# Altium schematic sheet [1] Supply.SchDoc
size A4; DocumentNumber: 2; SheetNumber: 2; SheetTotal: 4
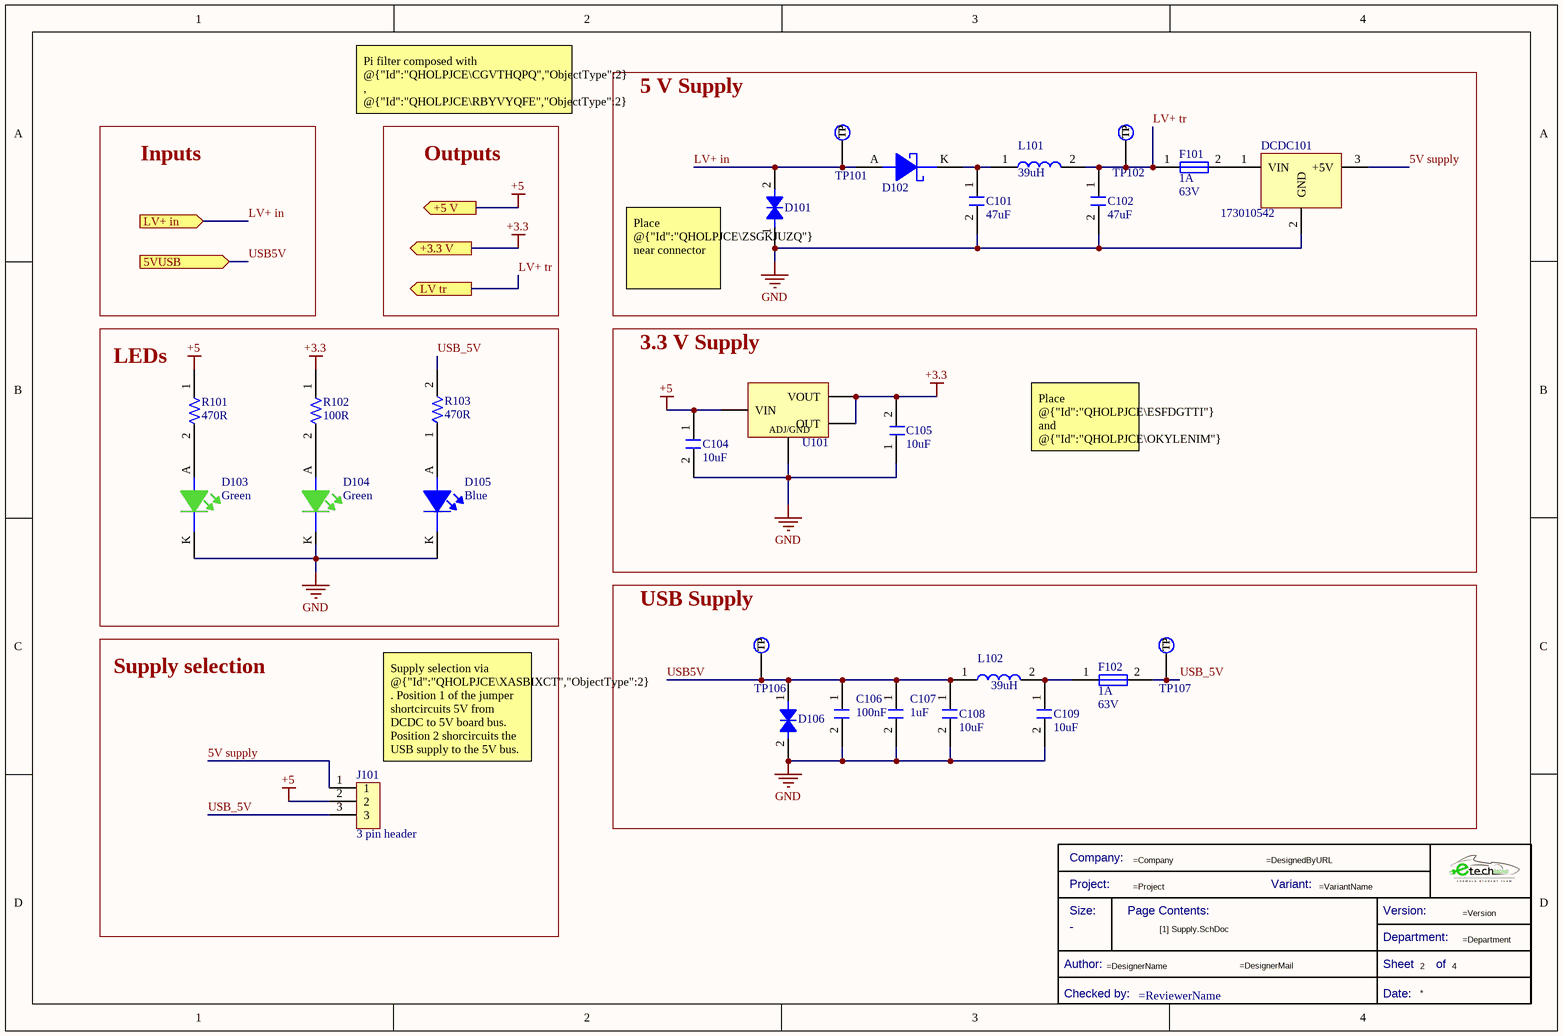
[diagram p0: [1] Supply.SchDoc]

## Parts
*?  Title Block_template  (value not drawn)  (graphical)
C101  Capacitance: 47uF  [C6.8n-2kV-1210FNPMLCC-X7R]  (hidden comment: C1210C682KGRACAUTO)
C102  Capacitance: 47uF  [C6.8n-2kV-1210FNPMLCC-X7R]  (hidden comment: C1210C682KGRACAUTO)
C104  Capacitance: 10uF  [C0805FNPC-R]  (hidden comment: 885012107014)
C105  Capacitance: 10uF  [C0805FNPC-R]  (hidden comment: 885012107014)
C106  Capacitance: 100nF  [C0805FNPC-R]  (hidden comment: 885012207098)
C107  Capacitance: 1uF  [C0805FNPC-R]  (hidden comment: 885012207103)
C108  10uF  [C0805FNPC-W]
C109  10uF  [C0805FNPC-W]
D101  824501261  [DTVS-DO-214AC]  (value not drawn)
D102  MBR0530  [DSC-SOD123]  (value not drawn)
D103  Color: Green  [LED_0805_WE]  (hidden comment: 150080GS75000)
D104  Color: Green  [LED_0805_WE]  (hidden comment: 150080GS75000)
D105  Color: Blue  [LED_1206_WE]  (hidden comment: 150120BS75000)
D106  824501131  [DTVS-DO-214AC]  (value not drawn)
DCDC101  173010542  [DCDC_Magi3c]
F101  Current Rating: 1A  Voltage Rating (DC): 63V  [Fuse_1206]  (hidden comment: 0437001.WRA)
F102  Current Rating: 1A  Voltage Rating (DC): 63V  [Fuse_1206]  (hidden comment: 0437001.WRA)
J101  3 pin header  [J3_PINHEADER]
L101  39uH  [L_47u-490mA_CF]
L102  39uH  [L_47u-490mA_CF]
R101  Resistance: 470R  [R0805FTK]  (hidden comment: CR0805-FX-4700GLF)
R102  Resistance: 100R  [R0805FTK]  (hidden comment: CR0805-FX-1000ELF)
R103  Resistance: 470R  [R0805FTK]  (hidden comment: CR0805-FX-4700GLF)
TP101  TestPoint  [TestPoint]  (value not drawn)  (no BOM)
TP102  TestPoint  [TestPoint]  (value not drawn)  (no BOM)
TP106  TestPoint  [TestPoint]  (value not drawn)  (no BOM)
TP107  TestPoint  [TestPoint]  (value not drawn)  (no BOM)
U101  LM1117IMP-3.3/NOPB  [LDO_10V-0.8/3V3-SOT223]  (value not drawn)

## Blocks framed on the sheet
5 V Supply: C101 C102 D101 D102 DCDC101 F101 L101 TP101 TP102
LEDs: D103-D105 R101-R103
3.3 V Supply: C104 C105 U101
USB Supply: C106-C109 D106 F102 L102 TP106 TP107
Supply selection: J101

## Ports
5VUSB (in), +3.3 V (out), +5 V (out), LV tr (out), LV+ in (in)

## Nets
+3.3: C105.2 R102.1 U101.2(OUT) U101.4(VOUT) ; port +3.3 V
+5: C104.1 J101.2 R101.1 U101.3(VIN) ; port +5 V
GND: C101.2 C102.2 C104.2 C105.1 C106.2 C107.2 C108.2 C109.2 D101.1 D103.K D104.K D105.K D106.2 DCDC101.2(GND) U101.1(ADJ/GND)
5V supply: DCDC101.3(+5V) J101.1
LV+ in: D101.2 D102.A TP101.1(TP) ; port LV+ in
LV+ tr: C102.1 F101.1 L101.2 TP102.1(TP) ; port LV tr
USB5V: C106.1 C107.1 C108.1 D106.1 L102.1 TP106.1(TP) ; port 5VUSB
USB_5V: F102.2 J101.3 R103.2 TP107.1(TP)
NetC101_1: C101.1 D102.K L101.1
NetC109_1: C109.1 F102.1 L102.2
NetD103_A: D103.A R101.2
NetD104_A: D104.A R102.2
NetD105_A: D105.A R103.1
NetDCDC101_1: DCDC101.1(VIN) F101.2

## Notes on the sheet
- Pi filter composed with @{"Id":"QHOLPJCE\CGVTHQPQ","ObjectType":2} , @{"Id":"QHOLPJCE\RBYVYQFE","ObjectType":2} and @{"Id":"QHOLPJCE\QHWORVIP"} is calculated to be cutting all frequencies higher than 7340 Hz
- Inputs
- Outputs
- Place @{"Id":"QHOLPJCE\ZSGKJUZQ"} near connector
- Place @{"Id":"QHOLPJCE\ESFDGTTI"} and @{"Id":"QHOLPJCE\OKYLENIM"} near @{"Id":"QHOLPJCE\XKTUAFZT"}
- (near J101) Supply selection via @{"Id":"QHOLPJCE\XASBIXCT","ObjectType":2} . Position 1 of the jumper shortcircuits 5V from DCDC to 5V board bus. Position 2 shorcircuits the USB supply to the 5V bus.
- (in symbol Title Block_template) Company:; Project:; Variant:; Size:; Page Contents:; Version:; Department:; Author:; Sheet; of; Checked by:; Date:

## Library data of the parts
*? = Title Block_template: Standard Title Block; .Creator: GP; Category: Title Block; .PCBcheck: GP; .SCHcheck: GP; Checked by:: =ReviewerName; Size: -
C101 C102 = C6.8n-2kV-1210FNPMLCC-X7R: Cap, AEC-Q200, 6800PF, 2KV, Mlcc, 1210;; Manufacturer: KEMET; Dielectric: X7R; Tolerance: 10%; .Creator: DR; Supplier 1: Digi-Key; Manufacturer Part Number: C1210C682KGRACAUTO; RoHS: Yes; Category: Ceramic Capacitors; Stock 1: 1000; Pricing 1: 1=0,78000, 10=0,55500, 50=0,41940, 100=0,36530, 500=0,27060 (USD); Case/Package: 1210; Case Code (Imperial): 1210; Case Code (Metric): 3225; Weight: 0.000564oz; Min Operating Temperature: -55°C; Max Operating Temperature: 125°C; Packaging: Tape and Reel; Termination: SMD/SMT; Voltage Rating (DC): 2kV; Package Quantity: 1000; Length: 3.2mm; Width: 2.5mm; RoHS Compliant: Yes; ComponentLink1URL: http://www.mouser.com/ds/2/212/KEM_C1010_X7R_HV_SMD-345925.pdf?src-supplier=Mouser; ComponentLink1Description: http://www.mouser.com/ds/2/212/KEM_C1010_X7R_HV_SMD-345925.pdf?src-supplier=Mouser; Supplier Part Number 1: 399-C1210C682KGRACAUTOCT-ND
C104 C105 = C10u-16V-0805FNPC-X5R: Multilayer Ceramic Capacitor, Wcap-Csgp Series, 10 F, 20%, X5R, 16 V, 0805 [2012 Metric] Rohs Compliant: Yes; Manufacturer 1: Wurth Electronics; Voltage Rating: 16V; .Creator: DR; Supplier 1: RSComponents; Manufacturer Part Number 1: 885012107014; RoHS: Yes; Category: Ceramic Capacitors; Stock 1: 81550; Pricing 1: 50=0,21000, 250=0,20200, 500=0,19100, 1000=0,17400, 2500=0,14700 (GBP); Mount: Surface Mount; Case/Package: 0805; Case Code (Metric): 2012; Case Code (Imperial): 0805; Min Operating Temperature: -55°C; Max Operating Temperature: 85°C; Packaging: Cut Tape; Dielectric: X5R; Tolerance: 20%; Voltage Rating (DC): 16V; Length: 0.079inch; Width: 0.049inch; Thickness: 0.057inch; REACH SVHC: Unknown; RoHS Compliant: Yes; ComponentLink1URL: http://www.farnell.com/datasheets/1958454.pdf?src-supplier=Farnell; ComponentLink1Description: http://www.farnell.com/datasheets/1958454.pdf?src-supplier=Farnell; ComponentLink2URL: http://www.farnell.com/datasheets/1958454.pdf?src-supplier=Element14; ComponentLink2Description: http://www.farnell.com/datasheets/1958454.pdf?src-supplier=Element14; ComponentLink3URL: https://katalog.we-online.de/pbs/datasheet/885012107014.pdf?src-supplier=Digi-Key; ComponentLink3Description: https://katalog.we-online.de/pbs/datasheet/885012107014.pdf?src-supplier=Digi-Key; ComponentLink4URL: http://www.farnell.com/datasheets/1958454.pdf?src-supplier=Newark; ComponentLink4Description: http://www.farnell.com/datasheets/1958454.pdf?src-supplier=Newark; Supplier Part Number 1: 1813526
C106 = C100n-50V-0805FNPC-X7R: Cap, 0.1ΜF, 50V, 10%, X7R, 0805; Manufacturer 1: Wurth Electronics; .Creator: DR; Supplier 1: RSComponents; Manufacturer Part Number 1: 885012207098; RoHS: Yes; Category: Ceramic Capacitors; Stock 1: 8000; Pricing 1: 100=0,10200, 500=0,07100, 2000=0,06100 (GBP); Mount: Surface Mount; Case/Package: 0805; Case Code (Metric): 2012; Case Code (Imperial): 0805; Min Operating Temperature: -55°C; Max Operating Temperature: 125°C; Packaging: Cut Tape; Voltage Rating: 50V; Dielectric: X7R; Tolerance: 10%; Voltage Rating (DC): 50V; Length: 0.079inch; Width: 0.049inch; Thickness: 0.035inch; REACH SVHC: Unknown; RoHS Compliant: Yes; ComponentLink1URL: http://www.farnell.com/datasheets/1958498.pdf?src-supplier=Farnell; ComponentLink1Description: http://www.farnell.com/datasheets/1958498.pdf?src-supplier=Farnell; ComponentLink2URL: http://www.farnell.com/datasheets/1958498.pdf?src-supplier=Element14; ComponentLink2Description: http://www.farnell.com/datasheets/1958498.pdf?src-supplier=Element14; ComponentLink3URL: https://katalog.we-online.de/pbs/datasheet/885012207098.pdf?src-supplier=Digi-Key; ComponentLink3Description: https://katalog.we-online.de/pbs/datasheet/885012207098.pdf?src-supplier=Digi-Key; ComponentLink4URL: http://www.farnell.com/datasheets/1958498.pdf?src-supplier=Newark; ComponentLink4Description: http://www.farnell.com/datasheets/1958498.pdf?src-supplier=Newark; Supplier Part Number 1: 1813493
C107 = C1u-50V-0805FNPC-X7R: Multilayer Ceramic Capacitor, Wcap-Csgp Series, 1 F, 10%, X7R, 50 V, 0805 [2012 Metric] Rohs Compliant: Yes; Manufacturer 1: Wurth Electronics; Voltage Rating: 50V; .Creator: GP; Supplier 1: RSComponents; Manufacturer Part Number 1: 885012207103; RoHS: Yes; Category: Ceramic Capacitors; Stock 1: 5100; Pricing 1: 50=0,27200, 250=0,25300, 500=0,22800, 1250=0,20100, 2500=0,17100 (GBP); Mount: Surface Mount; Case/Package: 0805; Case Code (Metric): 2012; Case Code (Imperial): 0805; Min Operating Temperature: -55°C; Max Operating Temperature: 85°C; Packaging: Cut Tape; Dielectric: X7R; Tolerance: 10%; Voltage Rating (DC): 50V; Length: 0.079inch; Width: 0.049inch; Thickness: 0.053inch; REACH SVHC: Unknown; RoHS Compliant: Yes; ComponentLink1URL: http://www.farnell.com/datasheets/1958501.pdf?src-supplier=Farnell; ComponentLink1Description: http://www.farnell.com/datasheets/1958501.pdf?src-supplier=Farnell; ComponentLink2URL: http://www.farnell.com/datasheets/1958501.pdf?src-supplier=Element14; ComponentLink2Description: http://www.farnell.com/datasheets/1958501.pdf?src-supplier=Element14; ComponentLink3URL: https://katalog.we-online.de/pbs/datasheet/885012107003.pdf?src-supplier=Digi-Key; ComponentLink3Description: https://katalog.we-online.de/pbs/datasheet/885012107003.pdf?src-supplier=Digi-Key; ComponentLink4URL: http://www.farnell.com/datasheets/1958501.pdf?src-supplier=Newark; ComponentLink4Description: http://www.farnell.com/datasheets/1958501.pdf?src-supplier=Newark; Supplier Part Number 1: 1813523
C108 C109 = C10uF-50V-0805FNPC
D101 = DTVS-26V-DO-214AC: TVS diode [Würth Elektronik] 824501261 TVS diode; Manufacturer: Wurth Electronics; Number of Bidirectional Channels: 1; Reverse Standoff Voltage: 26V; Min Breakdown Voltage: 30.4V; Clamping Voltage: 42.1V; Peak Pulse Power: 400W; Power Line Protection: No; Polarity: Bidirectional; Peak Pulse Current: 9.5A; .Creator: DO; Supplier 1: RSComponents; Manufacturer Part Number: 824501261; RoHS: Yes; Category: TVS Diodes; Stock 1: 1; Pricing 1: 50=0,29400, 250=0,26100, 500=0,21200, 1000=0,20100, 2000=0,19600 (USD); Mount: Surface Mount; Number of Pins: 2; Min Operating Temperature: -65°C; Max Operating Temperature: 150°C; Packaging: Cut Tape; Max Breakdown Voltage: 30.4V; Resistor Type: Zener; REACH SVHC: Unknown; RoHS Compliant: Yes; ComponentLink1URL: http://www.farnell.com/datasheets/2036389.pdf?src-supplier=Farnell; ComponentLink1Description: http://www.farnell.com/datasheets/2036389.pdf?src-supplier=Farnell; ComponentLink2URL: http://www.farnell.com/datasheets/2036389.pdf?src-supplier=Element14; ComponentLink2Description: http://www.farnell.com/datasheets/2036389.pdf?src-supplier=Element14; ComponentLink3URL: https://katalog.we-online.de/pbs/datasheet/824501261.pdf?src-supplier=Digi-Key; ComponentLink3Description: https://katalog.we-online.de/pbs/datasheet/824501261.pdf?src-supplier=Digi-Key; Supplier Part Number 1: 9217305; ComponentLink4Description: Where buy it; ComponentLink4URL: https://www.we-online.com/catalog/en/WE-TVSP?sq=824501261#824501261
D102 = DSC-0.5/30-SOD123: VR=30V IF=500mA 30pF P=410mW; Element Configuration: Single; Forward Voltage: 430mV; Peak Non-Repetitive Surge Current: 5.5A; Average Rectified Current: 500mA; Max Reverse Leakage Current: 130uA; Max Reverse Voltage (DC): 30V; Polarity: Standard; .Creator: GP; Category: Diode; ComponentLink1Description: Datasheet; ComponentLink1URL: *; ComponentLink2Description: Where buy it; ComponentLink2URL: *; Supplier 1: Newark; Stock 1: 9; Pricing 1: 1=0,34400, 10=0,23900, 100=0,12200, 500=0,10000 (USD); Mount: Surface Mount; Contact Plating: Tin,Matte; Weight: 0.03g; Package Quantity: 1; Max Surge Current: 5.5A; Forward Current: 500mA; Max Reverse Current: 130uA; Max Repetitive Reverse Voltage (Vrrm): 30V; Max Forward Surge Current (Ifsm): 5.5A; Voltage Rating (DC): 30V; Current Rating: 500mA; Output Current: 500mA; Series: -; Length: 2.7mm; Width: 1.6mm; Height: 1.03mm; Radiation Hardening: No; RoHS Compliant: Yes; REACH SVHC: No SVHC; Lead Free: Lead Free; ComponentLink3URL: https://datasheet.ciiva.com/30479/0900766b810e2512-30479401.pdf?src-supplier=RSComponents; ComponentLink3Description: https://datasheet.ciiva.com/30479/0900766b810e2512-30479401.pdf?src-supplier=RSComponents; ComponentLink4URL: https://datasheet.ciiva.com/34301/974753-34301826.pdf?src-supplier=Jameco; ComponentLink4Description: https://datasheet.ciiva.com/34301/974753-34301826.pdf?src-supplier=Jameco; ComponentLink5URL: https://datasheet.ciiva.com/910/mbr0530-910516.pdf?src-supplier=Digi-Key; ComponentLink5Description: https://datasheet.ciiva.com/910/mbr0530-910516.pdf?src-supplier=Digi-Key; ComponentLink6URL: https://datasheet.ciiva.com/25931/mbr0530-25931989.pdf?src-supplier=Avnet+Europe; ComponentLink6Description: https://datasheet.ciiva.com/25931/mbr0530-25931989.pdf?src-supplier=Avnet+Europe; ComponentLink7URL: https://datasheet.ciiva.com/8300/mbr0530-8300905.pdf?src-supplier=Avnet; ComponentLink7Description: https://datasheet.ciiva.com/8300/mbr0530-8300905.pdf?src-supplier=Avnet; ComponentLink8URL: https://datasheet.ciiva.com/17318/mbr0530-17318568.pdf?src-supplier=Future+Electronics; ComponentLink8Description: https://datasheet.ciiva.com/17318/mbr0530-17318568.pdf?src-supplier=Future+Electronics; ComponentLink9URL: https://datasheet.ciiva.com/15144/getdatasheetpartid-86760-15144598.pdf?src-supplier=Verical; ComponentLink9Description: https://datasheet.ciiva.com/15144/getdatasheetpartid-86760-15144598.pdf?src-supplier=Verical; ComponentLink10URL: https://datasheet.ciiva.com/910/mbr0530-910518.pdf?src-supplier=Digi-Key; ComponentLink10Description: https://datasheet.ciiva.com/910/mbr0530-910518.pdf?src-supplier=Digi-Key; Supplier Part Number 1: 15R3453; Parameter 1: *
D103 D104 = LEDGS-0805-450: Led, Green, 520 Nm, 3.2 V, 30 Ma, 450 Mcd Rohs Compliant: Yes; Manufacturer 1: Wurth Electronics; Viewing Angle: 140°; Lens Style: Clear,Rectangular; Luminous Intensity: 450mcd; Forward Voltage: 3.2V; Wavelength: 520nm; Forward Current: 30mA; Test Current: 20mA; .Creator: GP; ComponentLink1Description: Datasheet; ComponentLink1URL: https://www.we-online.com/catalog/datasheet/150080GS75000.pdf; ComponentLink2Description: Where buy it; ComponentLink2URL: https://katalog.we-online.de/en/led/WL-SMCW/150080GS75000; Supplier 1: RSComponents; Manufacturer Part Number 1: 150080GS75000; RoHS: Yes; Category: LEDs; Stock 1: 4350; Pricing 1: 50=0,19300, 500=0,12900, 1000=0,12300, 2000=0,11700, 4000=0,11100 (USD); Mount: Surface Mount; Case/Package: 0805; Case Code (Metric): 2012; Case Code (Imperial): 0805; Min Operating Temperature: -40°C; Max Operating Temperature: 85°C; Package Quantity: 4000; Packaging: Cut Tape; Dominant Wavelength: 520nm; Length: 2mm; Width: 1.25mm; Height: 0.7mm; REACH SVHC: Unknown; RoHS Compliant: Yes; ComponentLink3URL: https://datasheet.ciiva.com/29563/150080gs75000-29563008.pdf?src-supplier=Digi-Key; ComponentLink3Description: https://datasheet.ciiva.com/29563/150080gs75000-29563008.pdf?src-supplier=Digi-Key; ComponentLink4URL: https://datasheet.ciiva.com/29279/759434-da-01-en-chipled-0805-w-kl-gruen-150080gs75000-29279039.pdf?src-supplier=Conrad; ComponentLink4Description: https://datasheet.ciiva.com/29279/759434-da-01-en-chipled-0805-w-kl-gruen-150080gs75000-29279039.pdf?src-supplier=Conrad; Supplier Part Number 1: 8154221
D105 = LEDBS-1206-145: Led, Blue, 470 Nm, 3.2 V, 30 Ma, 145 Mcd Rohs Compliant: Yes; Manufacturer: Wurth Electronics; Luminous Intensity: 145mcd; Viewing Angle: 140°; Wavelength: 470nm; Forward Current: 30mA; Lens Style: Clear,Rectangular; Test Current: 20mA; Forward Voltage: 3.2V; .Creator: GP; Supplier 1: RSComponents; Manufacturer Part Number: 150120BS75000; RoHS: Yes; Category: LEDs; Stock 1: 1; Pricing 1: 50=0,23200, 500=0,16400, 750=0,15500, 1500=0,15000, 3000=0,14200 (USD); Mount: Surface Mount; Case/Package: 1206; Case Code (Metric): 3216; Case Code (Imperial): 1206; Min Operating Temperature: -40°C; Max Operating Temperature: 85°C; Package Quantity: 3000; Packaging: Tape and Reel; Dominant Wavelength: 470nm; Length: 3.2mm; Width: 1.6mm; Height: 0.68mm; REACH SVHC: Unknown; RoHS Compliant: Yes; ComponentLink1URL: https://datasheet.ciiva.com/22656/150120bs75000-22656976.pdf?src-supplier=Element14; ComponentLink1Description: https://datasheet.ciiva.com/22656/150120bs75000-22656976.pdf?src-supplier=Element14; ComponentLink2URL: https://datasheet.ciiva.com/29279/759440-da-01-en-chipled-1206-w-kl-blau-150120bs75000-29279045.pdf?src-supplier=Conrad; ComponentLink2Description: https://datasheet.ciiva.com/29279/759440-da-01-en-chipled-1206-w-kl-blau-150120bs75000-29279045.pdf?src-supplier=Conrad; ComponentLink3URL: https://datasheet.ciiva.com/29561/150120bs75000-29561882.pdf?src-supplier=Digi-Key; ComponentLink3Description: https://datasheet.ciiva.com/29561/150120bs75000-29561882.pdf?src-supplier=Digi-Key; Supplier Part Number 1: 8154243; ComponentLink4Description: Where buy it; ComponentLink4URL: https://www.we-online.com/catalog/en/WL-SMCW?sq=150120BS75000#150120BS75000
D106 = DTVS-13V-DO-214AC: Tvs Diode, 400W, 13V, Bidir, DO-214AC; Manufacturer: Wurth Electronics; Number of Bidirectional Channels: 1; Min Breakdown Voltage: 15.15V; Clamping Voltage: 21.5V; Power Line Protection: No; Polarity: Bidirectional; Peak Pulse Current: 18.6A; .Creator: DO; Supplier 1: Digi-Key; Manufacturer Part Number: 824501131; RoHS: Yes; Category: TVS Diodes; Stock 1: 1000; Pricing 1: 1=0,27000 (USD); Mount: Surface Mount; Number of Pins: 2; Min Operating Temperature: -65°C; Max Operating Temperature: 150°C; Packaging: Cut Tape; Reverse Standoff Voltage: 13V; Peak Pulse Power: 400W; Max Breakdown Voltage: 15.15V; Resistor Type: Zener; REACH SVHC: Unknown; RoHS Compliant: Yes; ComponentLink1URL: https://katalog.we-online.de/pbs/datasheet/824501131.pdf?src-supplier=Digi-Key; ComponentLink1Description: https://katalog.we-online.de/pbs/datasheet/824501131.pdf?src-supplier=Digi-Key; ComponentLink2URL: http://www.farnell.com/datasheets/2036399.pdf?src-supplier=Element14; ComponentLink2Description: http://www.farnell.com/datasheets/2036399.pdf?src-supplier=Element14; ComponentLink3Description: Where buy it; ComponentLink3URL: https://www.we-online.com/catalog/en/WE-TVSP?sq=824501131#824501131; Supplier Part Number 1: 732-824501131CT-ND
DCDC101 = DCDC-42V/5V-1A: Würth Elektronik 8-42V to 5V 1A DC-DC; Manufacturer 1: Wurth Electronics; Number of Outputs: 1; Min Input Voltage: 8V; Max Input Voltage: 42V; Efficiency: 93%; .Creator: DR; Supplier 1: RSComponents; Manufacturer Part Number 1: 173010542; RoHS: Yes; Stock 1: 1; Pricing 1: 1=12,22500, 8=10,96900, 21=10,68900 (USD); Mount: Through Hole; Min Operating Temperature: -40°C; Max Operating Temperature: 85°C; Features: UVLO,OCP,OTP,SCP; Packaging: Rail/Tube; Voltage - Output 1: 5V; Max Output Current: 1A; RoHS Compliant: Yes; ComponentLink1URL: http://www.farnell.com/datasheets/2192895.pdf?src-supplier=Farnell; ComponentLink1Description: http://www.farnell.com/datasheets/2192895.pdf?src-supplier=Farnell; ComponentLink2URL: http://www.farnell.com/datasheets/2192895.pdf?src-supplier=Newark; ComponentLink2Description: http://www.farnell.com/datasheets/2192895.pdf?src-supplier=Newark; ComponentLink3URL: https://katalog.we-online.de/pm/datasheet/173010542.pdf?src-supplier=Digi-Key; ComponentLink3Description: https://katalog.we-online.de/pm/datasheet/173010542.pdf?src-supplier=Digi-Key; Supplier Part Number 1: 1447809
F101 F102 = Fuse_1A_63V_1206: Fuse Chip Fast Acting 1A 63V SMD Solder Pad 1206 Ceramic T/R Automotive; Manufacturer: Littelfuse; Fuse Type: Board Mount (Cartridge Style Excluded); Approvals: CSA,cURus; .Creator: DO; Supplier 1: Digi-Key; Manufacturer Part Number: 0437001.WRA; RoHS: Yes; Category: Fuses; Stock 1: 5820; Pricing 1: 1=1,52000, 5=1,47000, 10=1,37600, 50=1,13860, 100=0,94880, 250=0,92508, 500=0,78276, 1000=0,68788 (USD); Mount: Surface Mount; Case/Package: 1206; Case Code (Imperial): 1206; Case Code (Metric): 3216; Min Operating Temperature: -55°C; Max Operating Temperature: 150°C; Packaging: Tape and Reel; Voltage Rating (AC): 63V; ComponentLink1URL: https://www.littelfuse.com/~/media/electronics/datasheets/fuses/littelfuse_fuse_437a_datasheet.pdf.pdf?src-supplier=Digi-Key; ComponentLink1Description: https://www.littelfuse.com/~/media/electronics/datasheets/fuses/littelfuse_fuse_437a_datasheet.pdf.pdf?src-supplier=Digi-Key; Supplier Part Number 1: F10001CT-ND; ComponentLink2Description: Where buy it; ComponentLink2URL: https://www.mouser.es/ProductDetail/Littelfuse/0437001WRA?qs=DXv0QSHKF4z9CJhPXjxR%252BA%3D%3D
J101 = J_Pinheader_1x3: 61300311121
L101 L102 = L_47u-490mA_CF: Inductor Power Unshielded Wirewound 47uH 10% 100KHz Ferrite 490mA 546mOhm DCR T/R; Manufacturer: Sumida; Manufacturer Part Number: CDC5D23BNP-470KC; DC Resistance (DCR): 546mR; .Creator: GP; Supplier 1: Mouser; RoHS: Yes; Category: Fixed Inductors; Stock 1: 3779; Pricing 1: 1=0,95000, 10=0,71100, 50=0,71100, 100=0,59700, 1000=0,40600, 10000=0,38100 (USD); Mount: Surface Mount; Case/Package: Nonstandard; Core Material: Ferrite; Weight: 0.007584oz; Min Operating Temperature: -40°C; Max Operating Temperature: 100°C; Tolerance: 10%; Shielding: Unshielded; Packaging: Tape and Reel; Package Quantity: 2000; Current Rating: 490mA; Inductance: 47uH; Max DC Current: 490mA; Termination: SMD/SMT; Test Frequency: 100kHz; Series: CDC5D23B; Length: 0.228inch; Width: 5.8mm; Height: 2.5mm; Height - Seated (Max): 0.098inch; Lead Free: Lead Free; RoHS Compliant: Yes; ComponentLink1URL: http://www.mouser.com/ds/2/390/CDC5D23B-465898.pdf?src-supplier=Mouser; ComponentLink1Description: http://www.mouser.com/ds/2/390/CDC5D23B-465898.pdf?src-supplier=Mouser; ComponentLink3URL: http://products.sumida.com/products/pdf/CDC5D23B.pdf?src-supplier=Digi-Key; ComponentLink3Description: http://products.sumida.com/products/pdf/CDC5D23B.pdf?src-supplier=Digi-Key; Supplier Part Number 1: 851-CDC5D23BNP-470KC
R101 R103 = R470-0805FTK: Res Thick Film 0805 470 Ohm 1% 1/8W ±100ppm/°C Molded SMD SMD Paper Tape on Plastic Reel; Manufacturer 1: Bourns; Power Rating: 125mW; Voltage Rating: 150V; .Creator: DR; Supplier 1: Arrow Electronics; Manufacturer Part Number 1: CR0805-FX-4700GLF; RoHS: Yes; Category: Chip SMD Resistors; Stock 1: 12623; Pricing 1: 1=0,00990, 10=0,00980, 25=0,00950, 50=0,00940, 100=0,00930, 250=0,00920, 500=0,00910, 1000=0,00890, 3000=0,00870, 6000=0,00860 (USD); Mount: Surface Mount; Case/Package: 0805; Number of Pins: 2; Case Code (Imperial): 0805; Case Code (Metric): 2012; Contact Plating: Tin; Min Operating Temperature: -55°C; Max Operating Temperature: 155°C; Packaging: Tape and Reel; Tolerance: 1%; Resistor Type: Thick Film; Termination: SMD/SMT; Temperature Coefficient: 100ppm/°C; Voltage Rating (DC): 150V; Features: Moisture Resistant; Series: CR0805; Max Power Dissipation: 125mW; Number of Terminations: 2; Resistance Tolerance: 1%; Construction: Rectangular; Technology: THICK FILM; Length: 2mm; Height: 0.5mm; Depth: 1.25mm; Thickness: 508um; Radiation Hardening: No; REACH SVHC: No SVHC; Military Standard: Not; ComponentLink1URL: https://datasheet.ciiva.com/11808/0900766b80fcdb72-11808686.pdf?src-supplier=RSComponents; ComponentLink1Description: https://datasheet.ciiva.com/11808/0900766b80fcdb72-11808686.pdf?src-supplier=RSComponents; ComponentLink2URL: https://datasheet.ciiva.com/7985/1856384-7985880.pdf?src-supplier=Element14; ComponentLink2Description: https://datasheet.ciiva.com/7985/1856384-7985880.pdf?src-supplier=Element14; ComponentLink3URL: https://datasheet.ciiva.com/22693/1902866-22693247.pdf?src-supplier=Element14; ComponentLink3Description: https://datasheet.ciiva.com/22693/1902866-22693247.pdf?src-supplier=Element14; ComponentLink4URL: https://datasheet.ciiva.com/5541/chpreztr-5541930.pdf?src-supplier=Mouser; ComponentLink4Description: https://datasheet.ciiva.com/5541/chpreztr-5541930.pdf?src-supplier=Mouser; Supplier Part Number 1: CR0805-FX-4700GLF
R102 = R100-0805FTK: Res Thick Film 0805 100 Ohm 1% 1/8W ±100ppm/°C Molded SMD SMD Paper Tape on Plastic Reel; Manufacturer 1: Bourns; Power Rating: 125mW; Voltage Rating: 150V; .Creator: DR; Supplier 1: Arrow Electronics; Manufacturer Part Number 1: CR0805-FX-1000ELF; RoHS: Yes; Category: Chip SMD Resistors; Stock 1: 49802; Pricing 1: 1=0,05840, 10=0,03430, 25=0,01780, 100=0,00750, 250=0,00560, 500=0,00490, 3000=0,00470 (USD); Mount: Surface Mount; Case/Package: 0805; Number of Pins: 2; Contact Plating: Tin; Case Code (Imperial): 0805; Case Code (Metric): 2012; Min Operating Temperature: -55°C; Max Operating Temperature: 155°C; Tolerance: 1%; Resistor Type: Thick Film; Temperature Coefficient: 100ppm/°C; Packaging: Tape and Reel; Package Quantity: 1; Termination: SMD/SMT; Number of Terminations: 2; Max Power Dissipation: 125mW; Voltage Rating (DC): 150V; Features: Moisture Resistant; Series: CR0805; Resistance Tolerance: 1%; Construction: Rectangular; Technology: THICK FILM; Length: 2mm; Width: 1.25mm; Height: 0.5mm; Depth: 1.25mm; Thickness: 508um; Radiation Hardening: No; REACH SVHC: No SVHC; Military Standard: Not; RoHS Compliant: Yes; ComponentLink1URL: https://datasheet.ciiva.com/11809/0900766b80fcdb72-11809178.pdf?src-supplier=RSComponents; ComponentLink1Description: https://datasheet.ciiva.com/11809/0900766b80fcdb72-11809178.pdf?src-supplier=RSComponents; ComponentLink2URL: https://datasheet.ciiva.com/6547/chpreztr-6547413.pdf?src-supplier=Digi-Key; ComponentLink2Description: https://datasheet.ciiva.com/6547/chpreztr-6547413.pdf?src-supplier=Digi-Key; ComponentLink3URL: https://datasheet.ciiva.com/6547/chpreztr-6547414.pdf?src-supplier=Digi-Key; ComponentLink3Description: https://datasheet.ciiva.com/6547/chpreztr-6547414.pdf?src-supplier=Digi-Key; ComponentLink4URL: https://datasheet.ciiva.com/6547/chpreztr-6547415.pdf?src-supplier=Digi-Key; ComponentLink4Description: https://datasheet.ciiva.com/6547/chpreztr-6547415.pdf?src-supplier=Digi-Key; ComponentLink5URL: https://datasheet.ciiva.com/9120/chpreztr-9120744.pdf?src-supplier=Avnet; ComponentLink5Description: https://datasheet.ciiva.com/9120/chpreztr-9120744.pdf?src-supplier=Avnet; Supplier Part Number 1: CR0805-FX-1000ELF
TP101 TP102 TP106 TP107 = TestPoint: Test Point 1x1 mm; .Creator: GP; Category: TestPoint; .PCBcheck: GP; .SCHcheck: GP
U101 = LDO_10V-0.8/3V3-SOT223: LDO Regulator Pos 3.3V 0.8A 4-Pin(3+Tab) SOT-223 T/R / IC REG LDO 3.3V 0.8A SOT223; Manufacturer: Texas Instruments; Number of Outputs: 1; Max Input Voltage: 15V; Max Output Current: 800mA; Polarity: Positive; Quiescent Current: 15mA; Accuracy: 1%; Output Type: Fixed; Dropout Voltage: 1.2V; Min Input Voltage: 2.6V; Max Supply Voltage: 10V; Min Supply Voltage: 4.75V; Current Rating: 800A; .Creator: GP; ComponentLink1URL: https://www.ti.com/lit/ds/symlink/lm1117.pdf?HQS=dis-mous-null-mousermode-dsf-pf-null-wwe&DCM=yes&ref_url=https%3A%2F%2Fwww.mouser.de%2F&distId=26; ComponentLink1Description: Datasheet; ComponentLink2Description: Where buy it; ComponentLink2URL: https://www.mouser.es/ProductDetail/Texas-Instruments/LM1117IMP-33-NOPB?qs=X1J7HmVL2ZFbpN1TgOsjYQ%3D%3D; Supplier 1: Digi-Key; Manufacturer Part Number: LM1117IMP-3.3/NOPB; RoHS: Yes; Category: LDO; Pricing 1: 1=1,41000, 10=1,26300, 25=1,19920, 100=0,98500, 250=0,92072, 500=0,81366 (USD); Mount: Surface Mount; Case/Package: SOT-223; Number of Pins: 4; Min Operating Temperature: -40°C; Max Operating Temperature: 125°C; Output Voltage: 3.3V; Packaging: Tape and Reel; Output Current: 800mA; Nominal Output Voltage: 3.3V; Termination: SMD/SMT; Output Voltage Accuracy: 1%; Number of Regulators: 1; Min Current Limit: 800mA; Package Quantity: 1000; Length: 6.5mm; Width: 3.56mm; Height: 1.6mm; Radiation Hardening: No; REACH SVHC: No SVHC; Lead Free: Lead Free; RoHS Compliant: Yes; ComponentLink3URL: https://datasheet.ciiva.com/27051/1281318-27051810.pdf?src-supplier=Jameco; ComponentLink3Description: https://datasheet.ciiva.com/27051/1281318-27051810.pdf?src-supplier=Jameco; ComponentLink4URL: https://datasheet.ciiva.com/8042/1670636-8042261.pdf?src-supplier=Element14; ComponentLink4Description: https://datasheet.ciiva.com/8042/1670636-8042261.pdf?src-supplier=Element14; ComponentLink5URL: https://datasheet.ciiva.com/1570/1849796-1570171.pdf?src-supplier=Farnell; ComponentLink5Description: https://datasheet.ciiva.com/1570/1849796-1570171.pdf?src-supplier=Farnell; ComponentLink6URL: https://datasheet.ciiva.com/14149/lm1117-eng-tds-14149980.pdf?src-supplier=Distrelec; ComponentLink6Description: https://datasheet.ciiva.com/14149/lm1117-eng-tds-14149980.pdf?src-supplier=Distrelec; ComponentLink7URL: https://datasheet.ciiva.com/46386/1882372-46386042.pdf?src-supplier=Element14; ComponentLink7Description: https://datasheet.ciiva.com/46386/1882372-46386042.pdf?src-supplier=Element14; ComponentLink8URL: https://datasheet.ciiva.com/3223/lm1117-n-3223515.pdf?src-supplier=Avnet; ComponentLink8Description: https://datasheet.ciiva.com/3223/lm1117-n-3223515.pdf?src-supplier=Avnet; ComponentLink9URL: https://datasheet.ciiva.com/6580/lm1117-n-6580030.pdf?src-supplier=Digi-Key; ComponentLink9Description: https://datasheet.ciiva.com/6580/lm1117-n-6580030.pdf?src-supplier=Digi-Key; ComponentLink10URL: https://datasheet.ciiva.com/6580/lm1117-n-6580026.pdf?src-supplier=Digi-Key; ComponentLink10Description: https://datasheet.ciiva.com/6580/lm1117-n-6580026.pdf?src-supplier=Digi-Key; Supplier Part Number 1: LM1117IMP-3.3/NOPBCT-ND